# EAGLE schematic Interupt Schematic (EAGLE 9.7.0)
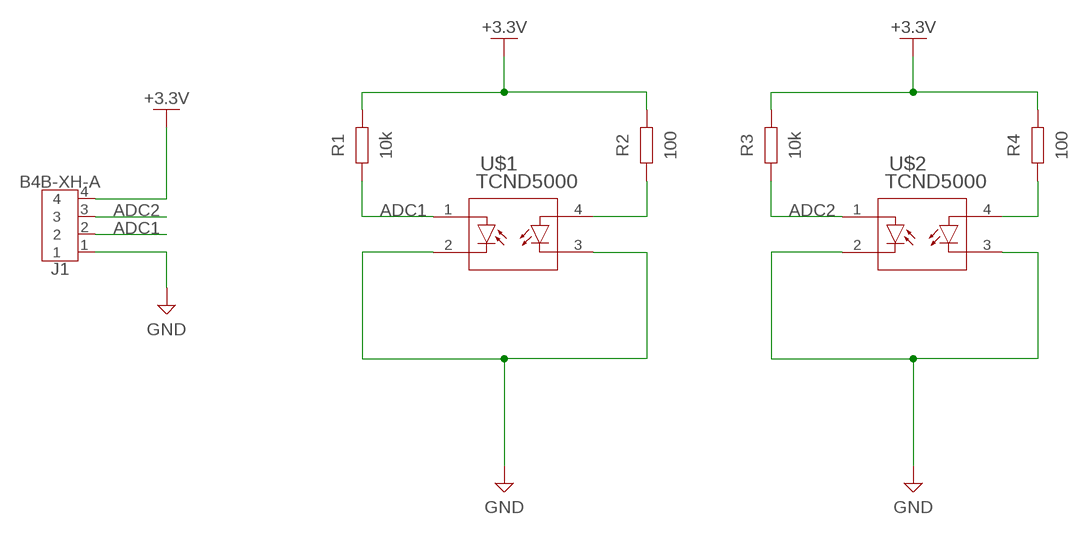
[diagram p0: schematic, sheet 1]

## Parts
J1  B4B-XH-A  [B4B-XH-A]
R1  10k  R_CHIP-0805(2012-METRIC)  [RESC2012X65]
R2  100  R_CHIP-0805(2012-METRIC)  [RESC2012X65]
R3  10k  R_CHIP-0805(2012-METRIC)  [RESC2012X65]
R4  100  R_CHIP-0805(2012-METRIC)  [RESC2012X65]
U$1  TCND5000  [TCND5000]
U$2  TCND5000  [TCND5000]

## Nets
+3.3V: J1.4 R1.2 R2.2 R3.2 R4.2
ADC1: J1.2 R1.1 U$1.1
ADC2: J1.3 R3.1 U$2.1
GND: J1.1 U$1.2 U$1.3 U$2.2 U$2.3
N$1: R2.1 U$1.4
N$2: R4.1 U$2.4

## Library data of the parts
J1 = Connector:B4B-XH-A: XH Connector Top Entry - 4POS Details see: Datasheet <http://www.jst-mfg.com/product/pdf/eng/eXH.pdf>; CATEGORY: Header; DATASHEET: https://www.jst-mfg.com/product/pdf/eng/eXH.pdf?67404de0bbae1; DESCRIPTION: Connector Header Through Hole 4 position 0.098" (2.50mm); MANUFACTURER: JST Sales America Inc.; MPN: B4B-XH-A; OPERATING_TEMPERATURE: -25°C ~ 85°C; PACKAGE_SIZE: NA; PACKAGE_TYPE: THT; PART_STATUS: ACTIVE; PITCH: 0.098" (2.50mm); ROHS: COMPLIANT; SERIES: XH; SUBCATEGORY: Rectangular Connectors; TYPE: Header-Male Pin-Board to Cable/Wire-Through Hole
R1-R4 = Resistor:R: Resistor Fixed - Generic; CATEGORY: Resistors; DESCRIPTION: Chip Resistor 2.00 X 1.25 X 0.65 mm body 0805(2012-METRIC) Package; PACKAGE_SIZE: 0805; PACKAGE_TYPE: SMD
U$1 U$2 = CohenLibrary:TCND5000: https://www.digikey.com/en/products/detail/vishay-semiconductor-opto-division/TCND5000/1681163